# EAGLE design 2 Port Memory (EAGLE 6.3)
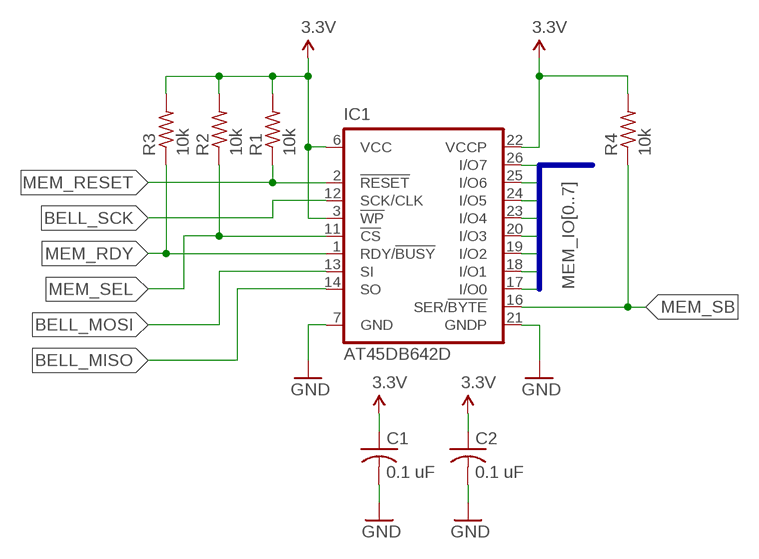
[diagram p0: schematic, sheet 1]

## Parts
C1  0.1 uF  CAP0603  [0603_CAP]
C2  0.1 uF  CAP0603  [0603_CAP]
IC1  AT45DB642D  [28T-TSOP-1]
R1  10k  RESISTOR0603  [0603_RESISTOR]
R2  10k  RESISTOR0603  [0603_RESISTOR]
R3  10k  RESISTOR0603  [0603_RESISTOR]
R4  10k  RESISTOR0603  [0603_RESISTOR]

## Nets
3.3V: C1.1 C2.1 IC1.3(!WP) IC1.6(VCC) IC1.22(VCCP) R1.2 R2.2 R3.2 R4.2
BELL_MISO: IC1.14(SO)
BELL_MOSI: IC1.13(SI)
BELL_SCK: IC1.12(SCK/CLK)
GND: C1.2 C2.2 IC1.7(GND) IC1.21(GNDP)
MEM_IO0: IC1.17(I/O0)
MEM_IO1: IC1.18(I/O1)
MEM_IO2: IC1.19(I/O2)
MEM_IO3: IC1.20(I/O3)
MEM_IO4: IC1.23(I/O4)
MEM_IO5: IC1.24(I/O5)
MEM_IO6: IC1.25(I/O6)
MEM_IO7: IC1.26(I/O7)
MEM_RDY: IC1.1(RDY/!BUSY) R3.1
MEM_RESET: IC1.2(!RESET) R1.1
MEM_SB: IC1.16(SER/!BYTE) R4.1
MEM_SEL: IC1.11(!CS) R2.1

## Buses
MEM_IO[0..7]

## Library data of the parts
C1 C2 = jkf:CAP; DIGIKEY#: 399-1096-1-ND
IC1 = jkf:AT45DB642D; DIGIKEY#: 1265-1010-ND; MANF: Adesto Technologies; MANF#: AT45DB642D-TU
R1 R2 R4 = jkf:RESISTOR; DIGIKEY#: P10KGCT-ND
R3 = jkf:RESISTOR; DIGIKEY#: P10KGCT-ND; MANF: Panasonic; MANF#: ERJ-3GEYJ103V

## Board
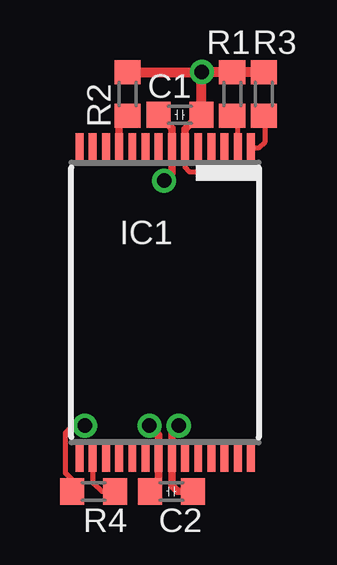
[diagram p1: board, top side]
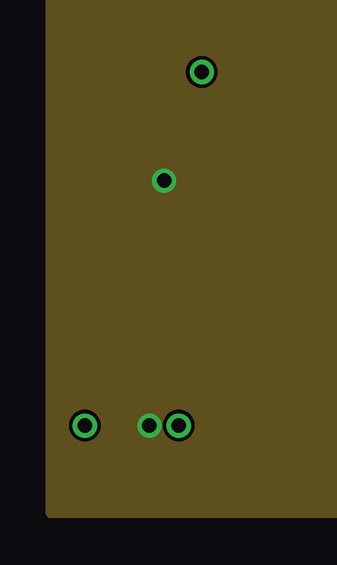
[diagram p2: board, inner layer GND]
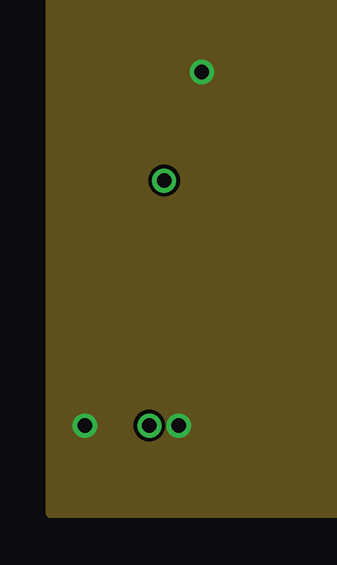
[diagram p3: board, inner layer 3.3V]

No outline drawn. Coordinates in mm, seen from the top.
Copper layers (1+2*15+16): Top 0.0178mm / dielectric 12mil / GND 0.0356mm / dielectric 28mil / 3.3V 0.0356mm / dielectric 12mil / Bottom 0.0178mm
Design rules "SSC-EAGLE-4Lyr_v1.0.0.3": minimum track width 6mil, minimum drill 8mil, track to track 6mil, track to pad 6mil, pad to pad 6mil, via to via 6mil, smd to smd 6mil, copper to edge 20mil, drill to drill 16mil, minimum pad ring 8mil, minimum via ring 8mil, stop-mask expansion 3mil, vias tented up to drill 0mil, thermal gap 10mil

### Footprints (pad centres in the part's own frame; a part is rotated, then mirrored left to right if it is on the bottom)
0603_CAP = smd 1 x 1.1: 1 -0.9,0; 2 0.9,0
28T-TSOP-1 = smd 1.2 x 0.33: 1 -6.45,3.575; 2 -6.45,3.025; 3 -6.45,2.475; 4 -6.45,1.925; 5 -6.45,1.375; 6 -6.45,0.825; 7 -6.45,0.275; 8 -6.45,-0.275; 9 -6.45,-0.825; 10 -6.45,-1.375; 11 -6.45,-1.925; 12 -6.45,-2.475; 13 -6.45,-3.025; 14 -6.45,-3.575; 15 6.45,-3.575; 16 6.45,-3.025; 17 6.45,-2.475; 18 6.45,-1.925; 19 6.45,-1.375; 20 6.45,-0.825; 21 6.45,-0.275; 22 6.45,0.275; 23 6.45,0.825; 24 6.45,1.375; 25 6.45,1.925; 26 6.45,2.475; 27 6.45,3.025; 28 6.45,3.575
0603_RESISTOR = smd 1 x 1.1: 1 -0.9,0; 2 0.9,0

### Placement (x,y rotation side)
C1  5.38,16.61 180 top
C2  5.03,0.91 180 top
IC1  4.78,8.79 270 top
R1  7.57,17.48 90 top
R2  3.2,17.48 90 top
R3  8.89,17.48 90 top
R4  1.78,0.91 180 top

### Tracks (layer width: path | path; a pad name or v marks a point on that pad's centre or on a via)
3.3V  (via drill 0.6)
  Top 0.203: IC1.6 5.6,14.41 5.79,14.22 7.11,14.22 7.25,14.36 IC1.3 | R4.2 0.88,1.41 0.61,1.68 0.61,3.35 0.91,3.66 v1.42,3.66
  Top 0.305: C2.1 5.28,0.91 5.05,1.15 IC1.22 5.05,3.37 v5.33,3.66 | IC1.6 5.6,16.01 6.2,16.61 C1.1
  Top 0.406: R3.2 R1.2 6.31,18.38 v6.3,18.39 6.29,18.38 | C1.1 6.29,18.38 | R2.2 6.29,18.38
  pour 3.3V: 0,22.86 15.24,22.86 15.24,0 0,0
GND  (via drill 0.6)
  Top 0.305: v4.72,13.87 5.05,14.19 IC1.7 5.05,16.05 C1.2 | C2.2 4.5,1.28 IC1.21 4.5,3.27 v4.12,3.66
  pour GND: 0,22.86 15.24,22.86 15.24,0 0,0
MEM_RDY
  Top 0.203: IC1.1 8.69,15.24 8.94,15.49 8.94,16.52 R3.1
MEM_RESET
  Top 0.203: IC1.2 7.8,16.34 R1.1
MEM_SB
  Top 0.203: IC1.16 1.75,1.3 2.13,0.91 R4.1
MEM_SEL
  Top 0.305: IC1.11 2.85,16.23 R2.1